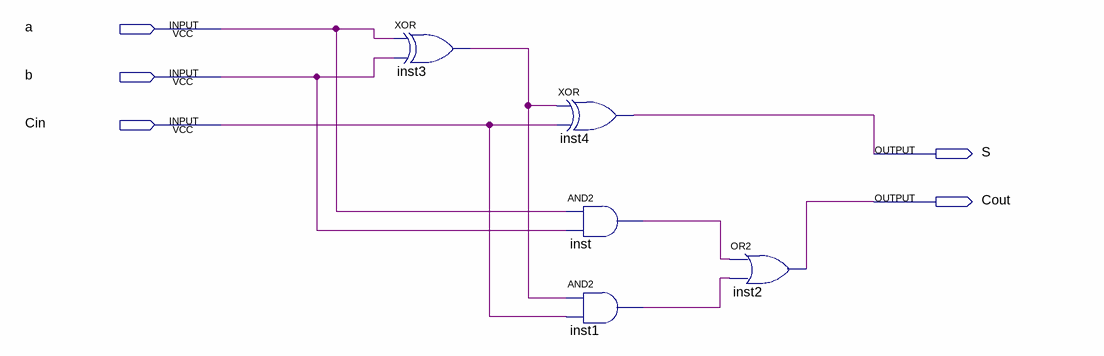
[diagram p0: schematic sheet]
// Quartus schematic FA1.bdf as structural Verilog: 5 symbols, 5 pins
module FA1 (
  input  a,
  input  b,
  input  Cin,
  output S,
  output Cout
);

  wire inst1_out, inst3_out, inst_out;

  xor inst3 (inst3_out, a, b);
  xor inst4 (S, inst3_out, Cin);
  and inst (inst_out, a, b);
  and inst1 (inst1_out, inst3_out, Cin);
  or inst2 (Cout, inst_out, inst1_out);
endmodule
